# Altium schematic sheet [02] - BOOT-Select.SchDoc
size A2
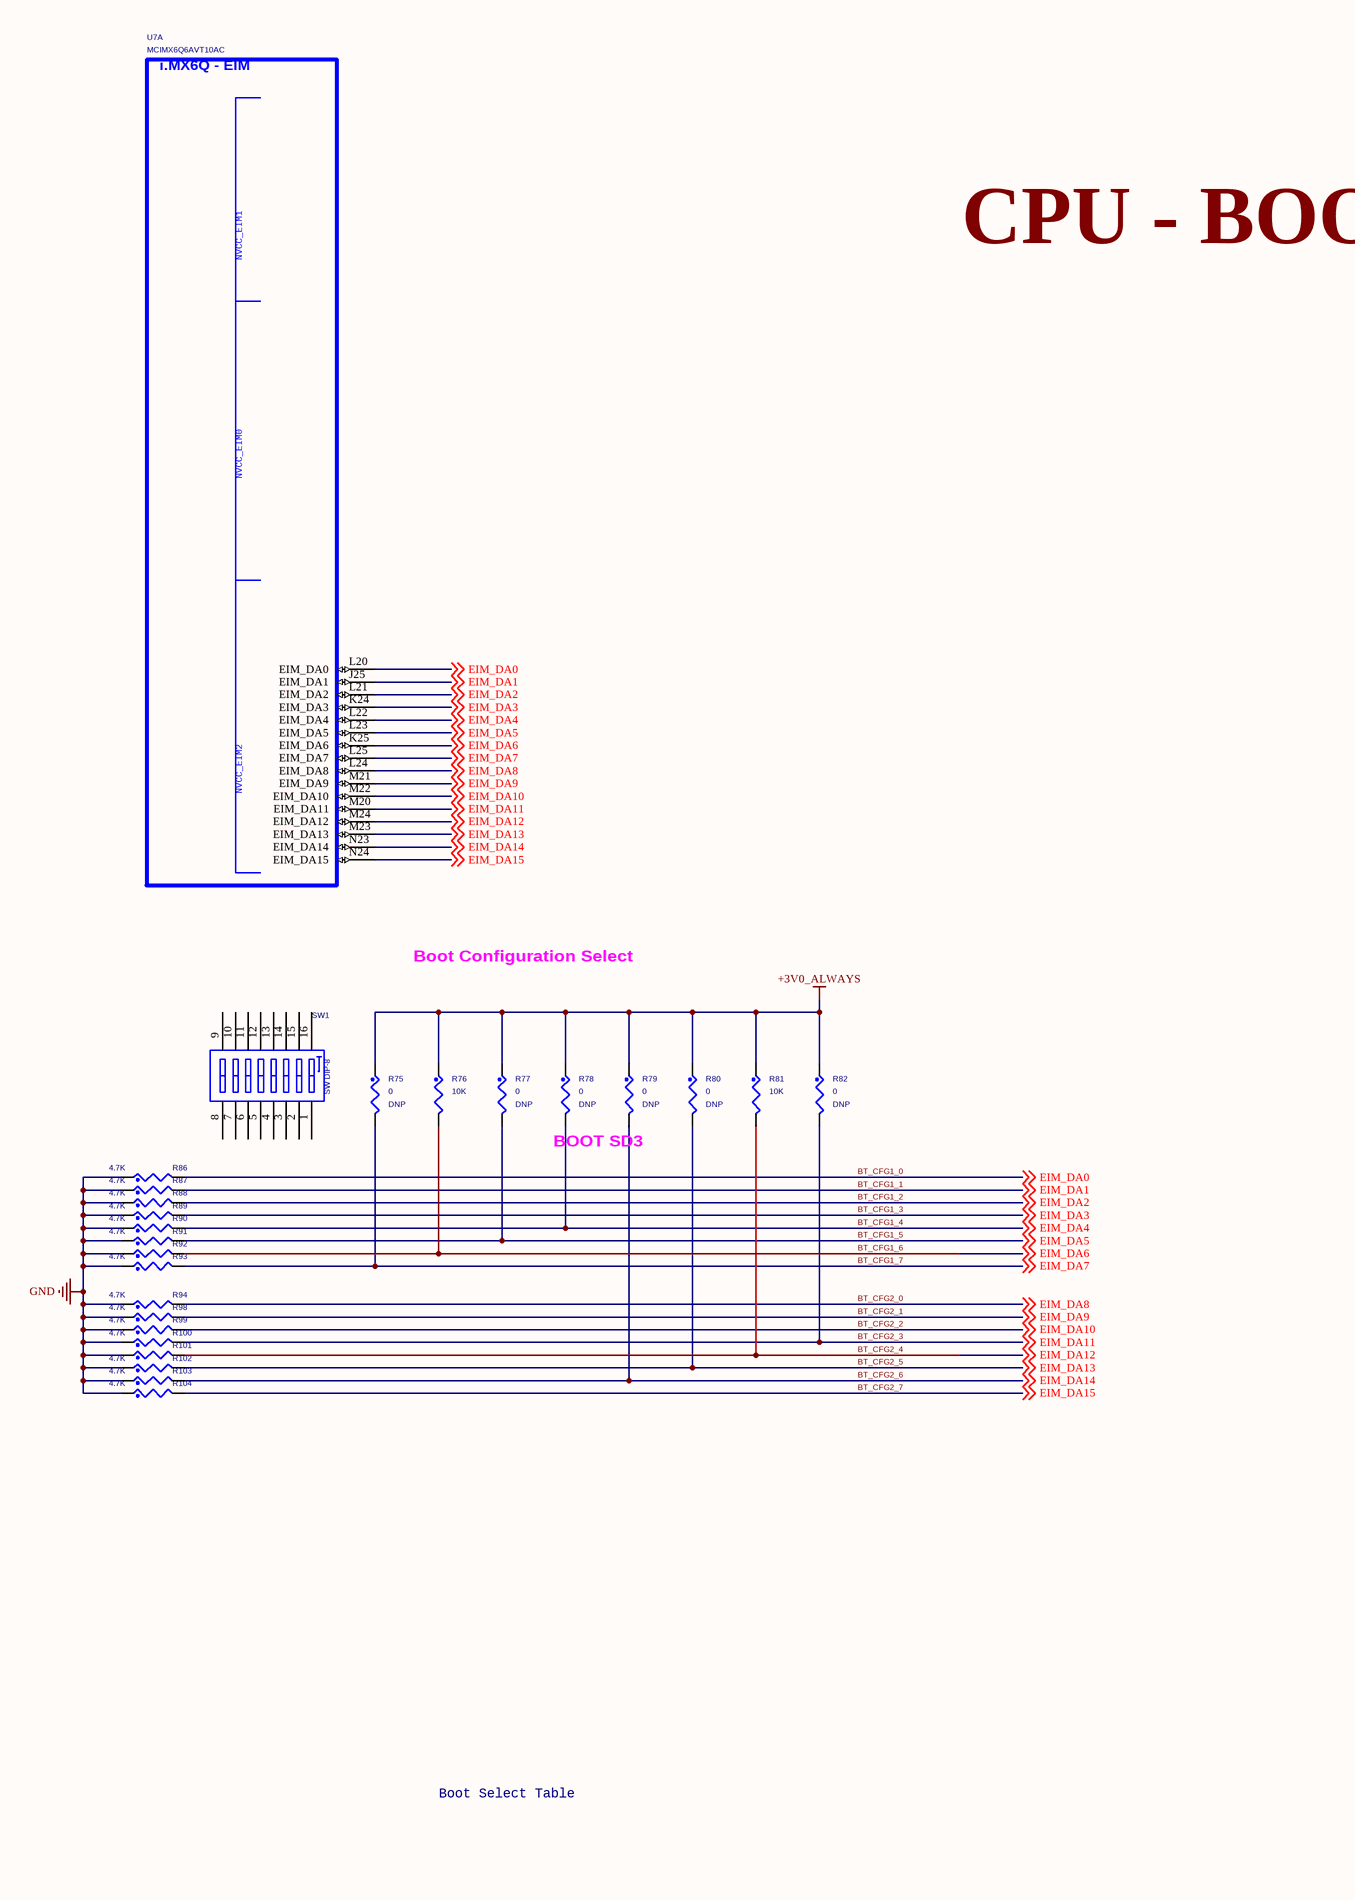
[diagram p0: [02] - BOOT-Select.SchDoc, left]
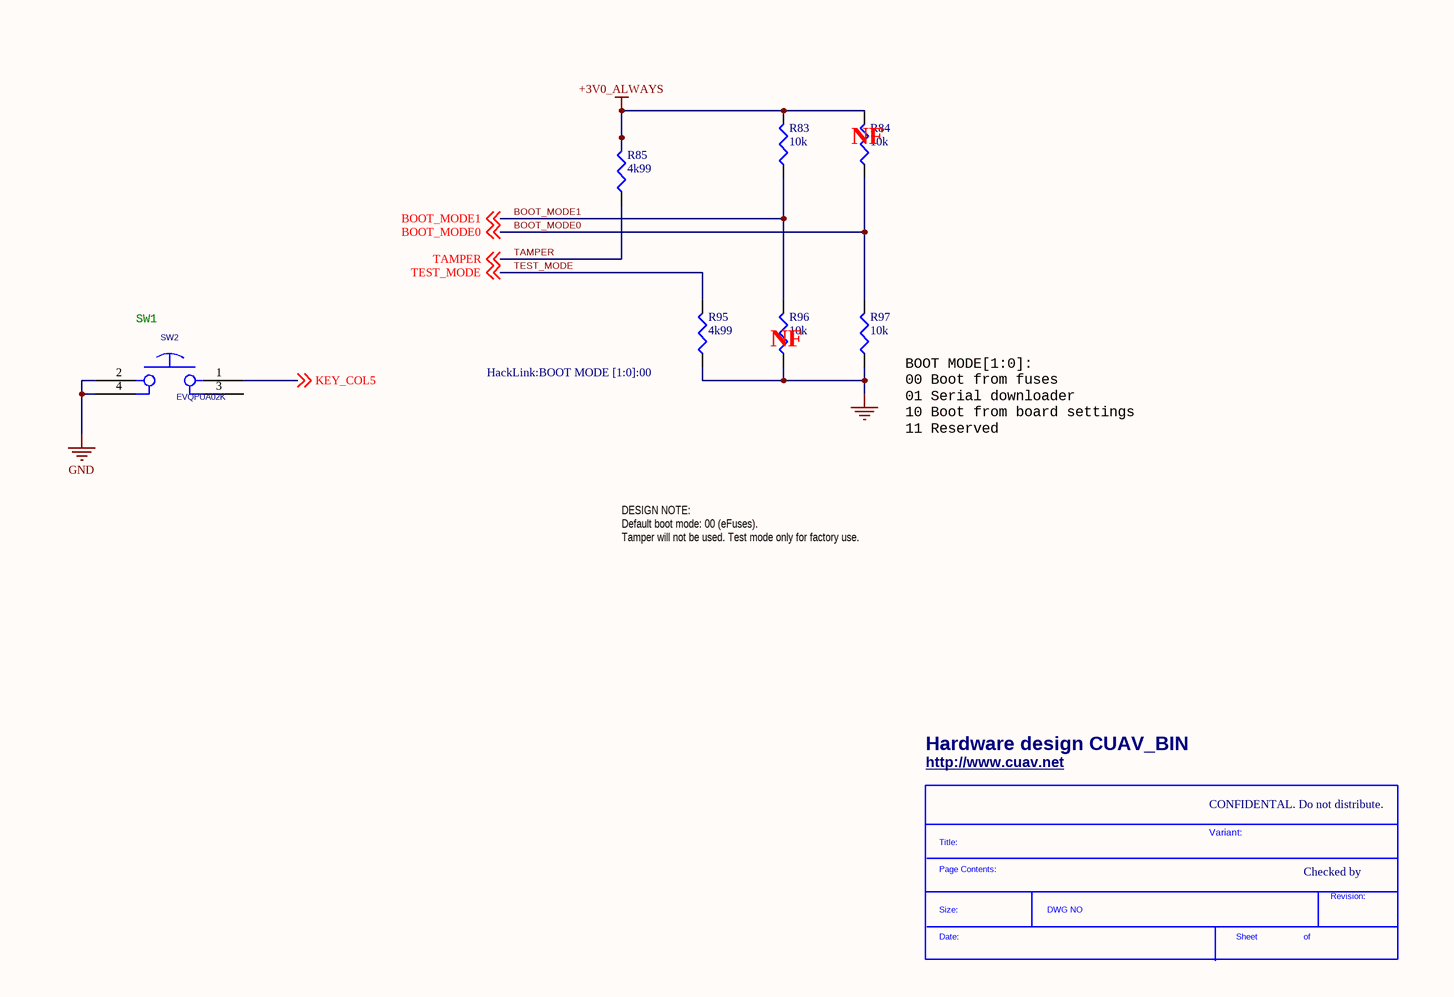
[diagram p1: [02] - BOOT-Select.SchDoc, right]

## Parts
*  SDTitleBlock  (value not drawn)  (graphical)
R75  0  ASSY_OPT: DNP  [0402r]
R76  10K  [0402r]
R77  0  ASSY_OPT: DNP  [0402r]
R78  0  ASSY_OPT: DNP  [0402r]
R79  0  ASSY_OPT: DNP  [0402r]
R80  0  ASSY_OPT: DNP  [0402r]
R81  10K  [0402r]
R82  0  ASSY_OPT: DNP  [0402R]
R83  10k  [R0402]
R84  10k  [R0402]
R85  4k99  [R0402]
R86  4.7K  [0402R]
R87  4.7K  [0402R]
R88  4.7K  [0402R]
R89  4.7K  [0402R]
R90  4.7K  [0402R]
R91  4.7K  [0402R]
R92  (no value)  [0402R]
R93  4.7K  [0402r]
R94  4.7K  [0402r]
R95  4k99  [R0402]
R96  10k  [R0402]
R97  10k  [R0402]
R98  4.7K  [0402r]
R99  4.7K  [0402r]
R100  4.7K  [0402r]
R101  (no value)  [0402r]
R102  4.7K  [0402r]
R103  4.7K  [0402r]
R104  4.7K  [0402r]
SW1  SW DIP-8
SW2  EVQPUA02K  [SKRPAB]
U7  MCIMX6Q6AVT10AC  (part A of 12)

## Nets
+3V0_ALWAYS: R75.1 R76.1 R77.1 R78.1 R79.1 R80.1 R81.1 R82.1 R83.2 R84.2 R85.2
GND: R86.1 R87.1 R88.1 R89.1 R90.1 R91.1 R92.1 R93.1 R94.1 R95.1 R96.1 R97.1 R98.1 R99.1 R100.1 R101.1 R102.1 R103.1 R104.1 SW2.2 SW2.4
BOOT_MODE0: R84.1 R97.2 ; off-sheet BOOT_MODE0
BOOT_MODE1: R83.1 R96.2 ; off-sheet BOOT_MODE1
BT_CFG1_0: R86.2 U7.L20(EIM_DA0) ; off-sheet EIM_DA0  [also labelled EIM_DA0]
BT_CFG1_1: R87.2 U7.J25(EIM_DA1) ; off-sheet EIM_DA1  [also labelled EIM_DA1]
BT_CFG1_2: R88.2 U7.L21(EIM_DA2) ; off-sheet EIM_DA2  [also labelled EIM_DA2]
BT_CFG1_3: R89.2 U7.K24(EIM_DA3) ; off-sheet EIM_DA3  [also labelled EIM_DA3]
BT_CFG1_4: R78.2 R90.2 U7.L22(EIM_DA4) ; off-sheet EIM_DA4  [also labelled EIM_DA4]
BT_CFG1_5: R77.2 R91.2 U7.L23(EIM_DA5) ; off-sheet EIM_DA5  [also labelled EIM_DA5]
BT_CFG1_6: R76.2 R92.2 U7.K25(EIM_DA6) ; off-sheet EIM_DA6  [also labelled EIM_DA6]
BT_CFG1_7: R75.2 R93.2 U7.L25(EIM_DA7) ; off-sheet EIM_DA7  [also labelled EIM_DA7]
BT_CFG2_0: R94.2 U7.L24(EIM_DA8) ; off-sheet EIM_DA8  [also labelled EIM_DA8]
BT_CFG2_1: R98.2 U7.M21(EIM_DA9) ; off-sheet EIM_DA9  [also labelled EIM_DA9]
BT_CFG2_2: R99.2 U7.M22(EIM_DA10) ; off-sheet EIM_DA10  [also labelled EIM_DA10]
BT_CFG2_3: R82.2 R100.2 U7.M20(EIM_DA11) ; off-sheet EIM_DA11  [also labelled EIM_DA11]
BT_CFG2_4: R81.2 R101.2 U7.M24(EIM_DA12) ; off-sheet EIM_DA12  [also labelled EIM_DA12]
BT_CFG2_5: R80.2 R102.2 U7.M23(EIM_DA13) ; off-sheet EIM_DA13  [also labelled EIM_DA13]
BT_CFG2_6: R79.2 R103.2 U7.N23(EIM_DA14) ; off-sheet EIM_DA14  [also labelled EIM_DA14]
BT_CFG2_7: R104.2 U7.N24(EIM_DA15) ; off-sheet EIM_DA15  [also labelled EIM_DA15]
KEY_COL5: SW2.1 ; off-sheet KEY_COL5
TAMPER: R85.1 ; off-sheet TAMPER
TEST_MODE: R95.2 ; off-sheet TEST_MODE

Not connected (* = marked no-connect by the designer): SW1 1 2 3 4 5 6 7 8 9 10 11 12 13 14 15 16; SW2 3

## Notes on the sheet
- CPU - BOOT
- Boot Configuration Select
- (near R84) NF
- BOOT SD3
- SW1
- (near R96) NF
- (near R95) HackLink:BOOT MODE [1:0]:00
- (near R97) BOOT MODE[1:0]:
  00 Boot from fuses
  01 Serial downloader
  10 Boot from board settings
  11 Reserved
- DESIGN NOTE:
  Default boot mode: 00 (eFuses).
  Tamper will not be used. Test mode only for factory use.
- (near *) Hardware design CUAV_BIN
- (near *) http://www.cuav.net
- CONFIDENTAL. Do not distribute.
- Boot Select Table
- Variant:
- Checked by
- (in symbol PCIMX6Q6VV1A, part A) i.MX6Q - EIM
- (in symbol SDTitleBlock) Title:; Page Contents:; Revision:; Size:; DWG NO; Date:; Sheet; of

## Library data of the parts
R75-R82 = RES: RES MF ZERO OHM 1/10W -- 0402; CLASS: DISCRETE; AGILE_PN: 470-79965; MFG_NAME01: Panasonic; MFG_PN01: ERJ-2GE0R00X; CAD_APPROVED: Yes; FPLIST: RC0402_25,RC0402_HD,RC0402_X2,0402_CC; SIGNAL_MODEL: DEFAULT_RESISTOR_0.001OHM_2_1; ROHS: Yes
R83 R84 R96 R97 = RC0402FR-0710KL: RES 10.0K OHM 1/16W 1% 0402 SMD; Manufacturer: Yageo; Power (Watts): 0.063W, 1/16W; Tolerance: ?%; .Checked PCB: used; Temperature Coefficient: ?00ppm/癈; Category: Resistors; Supplier Part Number: 311-10.0KLRCT-ND; Manufacturer Part Number: RC0402FR-0710KL; Package / Case: 0402 (1005 Metric); Price 1k [$]: 0.01421; Resistance (Ohms): 10K; Value: 10k; .Checked SCH: used; Supplier: Digikey; Supplier 1: Digi-Key; Supplier Part Number 1: 311-10.0KLRCT-ND; RoHS: RoHS Compliant; Stock 1: 2916495; Pricing 1: 10=0.014, 50=0.0104, 100=0.0079, 250=0.00584, 500=0.00432, 1000=0.00288 (USD); Composition: Thick Film; Features: -; Size / Dimension: 0.039" L x 0.020" W (1.00mm x 0.50mm); Height: 0.016" (0.40mm); Number of Terminations: 2; Packaging: Cut Tape (CT); ComponentLink1URL: http://www.yageo.com/documents/recent/PYu-RC0402_51_RoHS_L_6.pdf; ComponentLink1Description: http://www.yageo.com/documents/recent/PYu-RC0402_51_RoHS_L_6.pdf
R85 R95 = RMCF0402FT4K99: RES TF 4.99K OHM 1% 1/16W 0402; Manufacturer: Stackpole Electronics Inc; Power (Watts): 0.063W, 1/16W; Tolerance: ?%; .Checked PCB: used; Temperature Coefficient: ?00ppm/癈; Category: Resistors; Supplier Part Number: RMCF0402FT4K99CT-ND; Manufacturer Part Number: RMCF0402FT4K99; Package / Case: 0402 (1005 Metric); Price 1k [$]: 0.00384; Resistance (Ohms): 4.99K; Value: 4k99; .Checked SCH: used; Supplier: Digikey; Supplier 1: Digi-Key; Supplier Part Number 1: RMCF0402FT4K99CT-ND; RoHS: RoHS Compliant; Stock 1: 48509; Pricing 1: 1=0.04, 10=0.025, 50=0.0138, 100=0.0105, 250=0.0078, 500=0.00576, 1000=0.00384 (USD); Composition: Thick Film; Features: -; Size / Dimension: 0.039" L x 0.020" W (1.00mm x 0.50mm); Height: 0.016" (0.40mm); Number of Terminations: 2; Packaging: Cut Tape (CT); ComponentLink1URL: http://www.seielect.com/Catalog/SEI-RMCF.pdf; ComponentLink1Description: http://www.seielect.com/Catalog/SEI-RMCF.pdf
R86-R93 R98-R104 = RES: RES MF 4.70K 1/16W 1% 0402; CLASS: DISCRETE; ROOM: ETM; AGILE_PN: 470-75418; MFG_NAME01: KOA SPEER; MFG_PN01: RK73H1ETTP4701F; CAD_APPROVED: Yes; PRIORITY_PN: 006-00619; SIGNAL_MODEL: DEFAULT_RESISTOR_4700OHM_2_1; Tolerance: 1%; ROHS: Yes
R94 = RES: RES MF 4.70K 1/16W 1% 0402; CLASS: DISCRETE; PRIORITY_PN: 006-00619; CAD_APPROVED: Yes; MFG_PN01: RK73H1ETTP4701F; MFG_NAME01: KOA SPEER; AGILE_PN: 470-75418; ROOM: ETM; SIGNAL_MODEL: DEFAULT_RESISTOR_4700OHM_2_1; ROHS: Yes; Tolerance: 1%
SW1 = SW_DIP_8: SW SPST DIP 24V 16.67MA SMT; CLASS: IC; AGILE_PN: 510-75134; MFG_NAME01: TYCO ELECTRONICS; MFG_PN01: 1-1571983-1; CAD_APPROVED: Yes; PRIORITY_PN: 040-00054; ROHS: Yes; HEIGHT: 2.36MM
SW2 = EDGE_MOUNT_PB_SW_2: SW SPST NO PB 2.2N SIDE 12V 50MA SMT; CLASS: IC; CAD_APPROVED: Yes; MFG_NAME01: PANASONIC; AGILE_PN: 510-76838; HEIGHT: 1.95MM; ROHS: Yes; MFG_PN01: EVQPUA02K
U7 = PCIMX6Q6VV1A: IC MCU MX6QUAD ARM CORTEX-A9 FCPBGA624; AGILE_PN: 344-01218; MFG_NAME01: FREESCALE SEMICONDUCTOR; CAD_APPROVED: Yes; CLASS: IC; MFG_PN01: MCIMX6Q6AVT10AC; ROHS: Yes; HEIGHT: 2.16MM